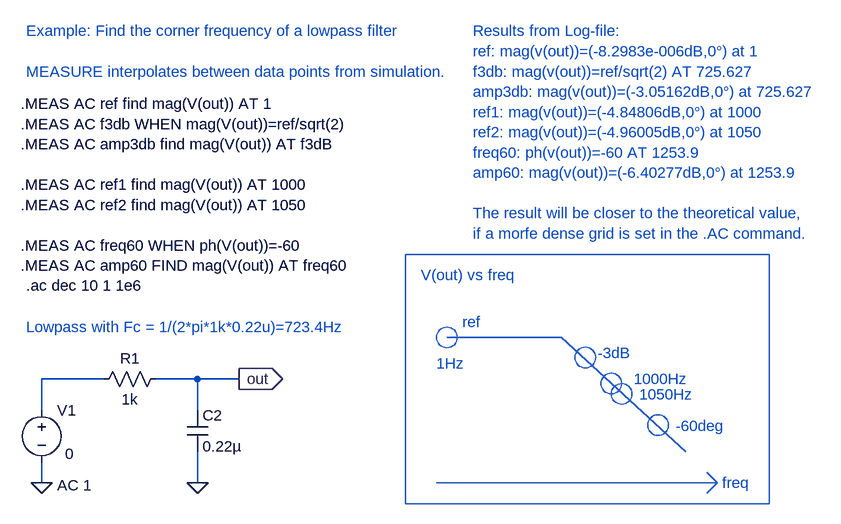
[diagram p0: schematic freq_3dB_ac1.asc]
freq_3dB_ac1.asc, the LTspice schematic file:
Version 4
SHEET 1 1180 736
WIRE 656 160 480 160
WIRE -48 224 -144 224
WIRE 96 224 32 224
WIRE 160 224 96 224
WIRE -144 272 -144 224
WIRE 96 272 96 224
WIRE -144 384 -144 352
WIRE 96 384 96 336
FLAG 96 384 0
FLAG -144 384 0
FLAG 160 224 out
IOPIN 160 224 Out
SYMBOL res -64 240 R270
WINDOW 0 32 56 VTop 0
WINDOW 3 0 56 VBottom 0
SYMATTR InstName R1
SYMATTR Value 1k
SYMBOL voltage -144 256 R0
WINDOW 123 24 132 Left 0
WINDOW 39 0 0 Left 0
WINDOW 3 36 83 Left 0
SYMATTR Value2 AC 1
SYMATTR Value 0
SYMATTR InstName V1
SYMBOL cap 80 272 R0
SYMATTR InstName C2
SYMATTR Value 0.22µ
TEXT -168 80 Left 0 !.ac dec 10 1 1e6
TEXT -168 144 Left 0 ;Lowpass with Fc = 1/(2*pi*1k*0.22u)=723.4Hz
TEXT -168 -312 Left 0 ;Example: Find the corner frequency of a lowpass filter\n \nMEASURE interpolates between data points from simulation.
TEXT 440 64 Left 0 ;V(out) vs freq
TEXT 904 384 Left 0 ;freq
TEXT 712 184 Left 0 ;-3dB
TEXT 504 136 Left 0 ;ref
TEXT 520 -312 Left 0 ;Results from Log-file:\nref: mag(v(out))=(-8.2983e-006dB,0°) at 1\nf3db: mag(v(out))=ref/sqrt(2) AT 725.627\namp3db: mag(v(out))=(-3.05162dB,0°) at 725.627\nref1: mag(v(out))=(-4.84806dB,0°) at 1000\nref2: mag(v(out))=(-4.96005dB,0°) at 1050\nfreq60: ph(v(out))=-60 AT 1253.9\namp60: mag(v(out))=(-6.40277dB,0°) at 1253.9\n  \nThe result will be closer to the theoretical value,\nif a morfe dense grid is set in the .AC command.
TEXT -176 -200 Left 0 !.MEAS AC ref find mag(V(out)) AT 1\n.MEAS AC f3db WHEN mag(V(out))=ref/sqrt(2)\n.MEAS AC amp3db find mag(V(out)) AT f3dB\n \n.MEAS AC ref1 find mag(V(out)) AT 1000\n.MEAS AC ref2 find mag(V(out)) AT 1050\n \n.MEAS AC freq60 WHEN ph(V(out))=-60\n.MEAS AC amp60 FIND mag(V(out)) AT freq60
TEXT 832 296 Left 0 ;-60deg
TEXT 768 224 Left 0 ;1000Hz
TEXT 776 248 Left 0 ;1050Hz
TEXT 464 200 Left 0 ;1Hz
LINE Normal 848 336 656 160
LINE Normal 848 336 848 336
LINE Normal 896 384 464 384
LINE Normal 880 400 896 384
LINE Normal 896 384 880 400
LINE Normal 880 368 896 384
RECTANGLE Normal 976 416 416 32
CIRCLE Normal 496 144 464 176
CIRCLE Normal 709 175 677 207
CIRCLE Normal 821 279 789 311
CIRCLE Normal 749 215 717 247
CIRCLE Normal 765 231 733 263

The netlist it stands for:
* freq_3dB_ac1.asc
R1 N002 out 1k
V1 N002 0 0 AC 1
C2 out 0 0.22µ
.ac dec 10 1 1e6
* Lowpass with Fc = 1/(2*pi*1k*0.22u)=723.4Hz
* Example: Find the corner frequency of a lowpass filter
* MEASURE interpolates between data points from simulation.
* V(out) vs freq
* freq
* -3dB
* ref
* Results from Log-file:
* ref: mag(v(out))=(-8.2983e-006dB,0°) at 1
* f3db: mag(v(out))=ref/sqrt(2) AT 725.627
* amp3db: mag(v(out))=(-3.05162dB,0°) at 725.627
* ref1: mag(v(out))=(-4.84806dB,0°) at 1000
* ref2: mag(v(out))=(-4.96005dB,0°) at 1050
* freq60: ph(v(out))=-60 AT 1253.9
* amp60: mag(v(out))=(-6.40277dB,0°) at 1253.9
* The result will be closer to the theoretical value,
* if a morfe dense grid is set in the .AC command.
.MEAS AC ref find mag(V(out)) AT 1
.MEAS AC f3db WHEN mag(V(out))=ref/sqrt(2)
.MEAS AC amp3db find mag(V(out)) AT f3dB
.MEAS AC ref1 find mag(V(out)) AT 1000
.MEAS AC ref2 find mag(V(out)) AT 1050
.MEAS AC freq60 WHEN ph(V(out))=-60
.MEAS AC amp60 FIND mag(V(out)) AT freq60
* -60deg
* 1000Hz
* 1050Hz
* 1Hz
.backanno
.end